# Altium schematic sheet DISPLAY.SchDoc: Parallel Display
size 420 x 297 mm; SheetNumber: 13
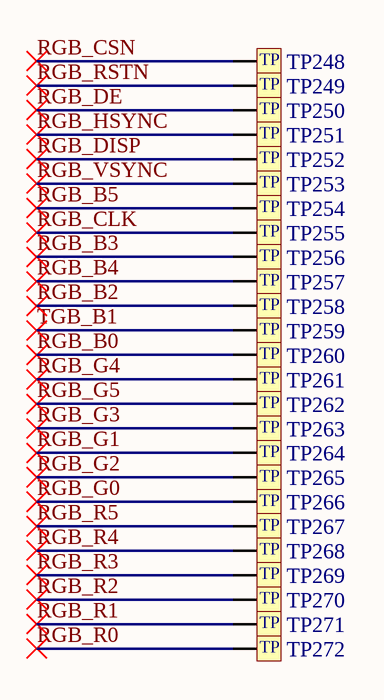
[diagram p0: DISPLAY.SchDoc]

## Parts
TP248  TP_0P8MM  [TP_0P8MM]  (value not drawn)  (no BOM)
TP249  TP_0P8MM  [TP_0P8MM]  (value not drawn)  (no BOM)
TP250  TP_0P8MM  [TP_0P8MM]  (value not drawn)  (no BOM)
TP251  TP_0P8MM  [TP_0P8MM]  (value not drawn)  (no BOM)
TP252  TP_0P8MM  [TP_0P8MM]  (value not drawn)  (no BOM)
TP253  TP_0P8MM  [TP_0P8MM]  (value not drawn)  (no BOM)
TP254  TP_0P8MM  [TP_0P8MM]  (value not drawn)  (no BOM)
TP255  TP_0P8MM  [TP_0P8MM]  (value not drawn)  (no BOM)
TP256  TP_0P8MM  [TP_0P8MM]  (value not drawn)  (no BOM)
TP257  TP_0P8MM  [TP_0P8MM]  (value not drawn)  (no BOM)
TP258  TP_0P8MM  [TP_0P8MM]  (value not drawn)  (no BOM)
TP259  TP_0P8MM  [TP_0P8MM]  (value not drawn)  (no BOM)
TP260  TP_0P8MM  [TP_0P8MM]  (value not drawn)  (no BOM)
TP261  TP_0P8MM  [TP_0P8MM]  (value not drawn)  (no BOM)
TP262  TP_0P8MM  [TP_0P8MM]  (value not drawn)  (no BOM)
TP263  TP_0P8MM  [TP_0P8MM]  (value not drawn)  (no BOM)
TP264  TP_0P8MM  [TP_0P8MM]  (value not drawn)  (no BOM)
TP265  TP_0P8MM  [TP_0P8MM]  (value not drawn)  (no BOM)
TP266  TP_0P8MM  [TP_0P8MM]  (value not drawn)  (no BOM)
TP267  TP_0P8MM  [TP_0P8MM]  (value not drawn)  (no BOM)
TP268  TP_0P8MM  [TP_0P8MM]  (value not drawn)  (no BOM)
TP269  TP_0P8MM  [TP_0P8MM]  (value not drawn)  (no BOM)
TP270  TP_0P8MM  [TP_0P8MM]  (value not drawn)  (no BOM)
TP271  TP_0P8MM  [TP_0P8MM]  (value not drawn)  (no BOM)
TP272  TP_0P8MM  [TP_0P8MM]  (value not drawn)  (no BOM)

## Nets
RGB_B0: TP260.1
RGB_B2: TP258.1
RGB_B3: TP256.1
RGB_B4: TP257.1
RGB_B5: TP254.1
RGB_CLK: TP255.1
RGB_CSN: TP248.1
RGB_DE: TP250.1
RGB_DISP: TP252.1
RGB_G0: TP266.1
RGB_G1: TP264.1
RGB_G2: TP265.1
RGB_G3: TP263.1
RGB_G4: TP261.1
RGB_G5: TP262.1
RGB_HSYNC: TP251.1
RGB_R0: TP272.1
RGB_R1: TP271.1
RGB_R2: TP270.1
RGB_R3: TP269.1
RGB_R4: TP268.1
RGB_R5: TP267.1
RGB_RSTN: TP249.1
RGB_VSYNC: TP253.1
TGB_B1: TP259.1

## Notes on the sheet
- PROJECT
- SIZE
- FILE NAME
- A3
- TITLE
- SHEET
- OF
- REV
- (in symbol TP_0P8MM) TP

## Library data of the parts
TP248-TP272 = TP_0P8MM: OSM Footprint 0P8 LGA Ball